# Altium schematic sheet schematic.SchDoc
size 533 x 331 mm
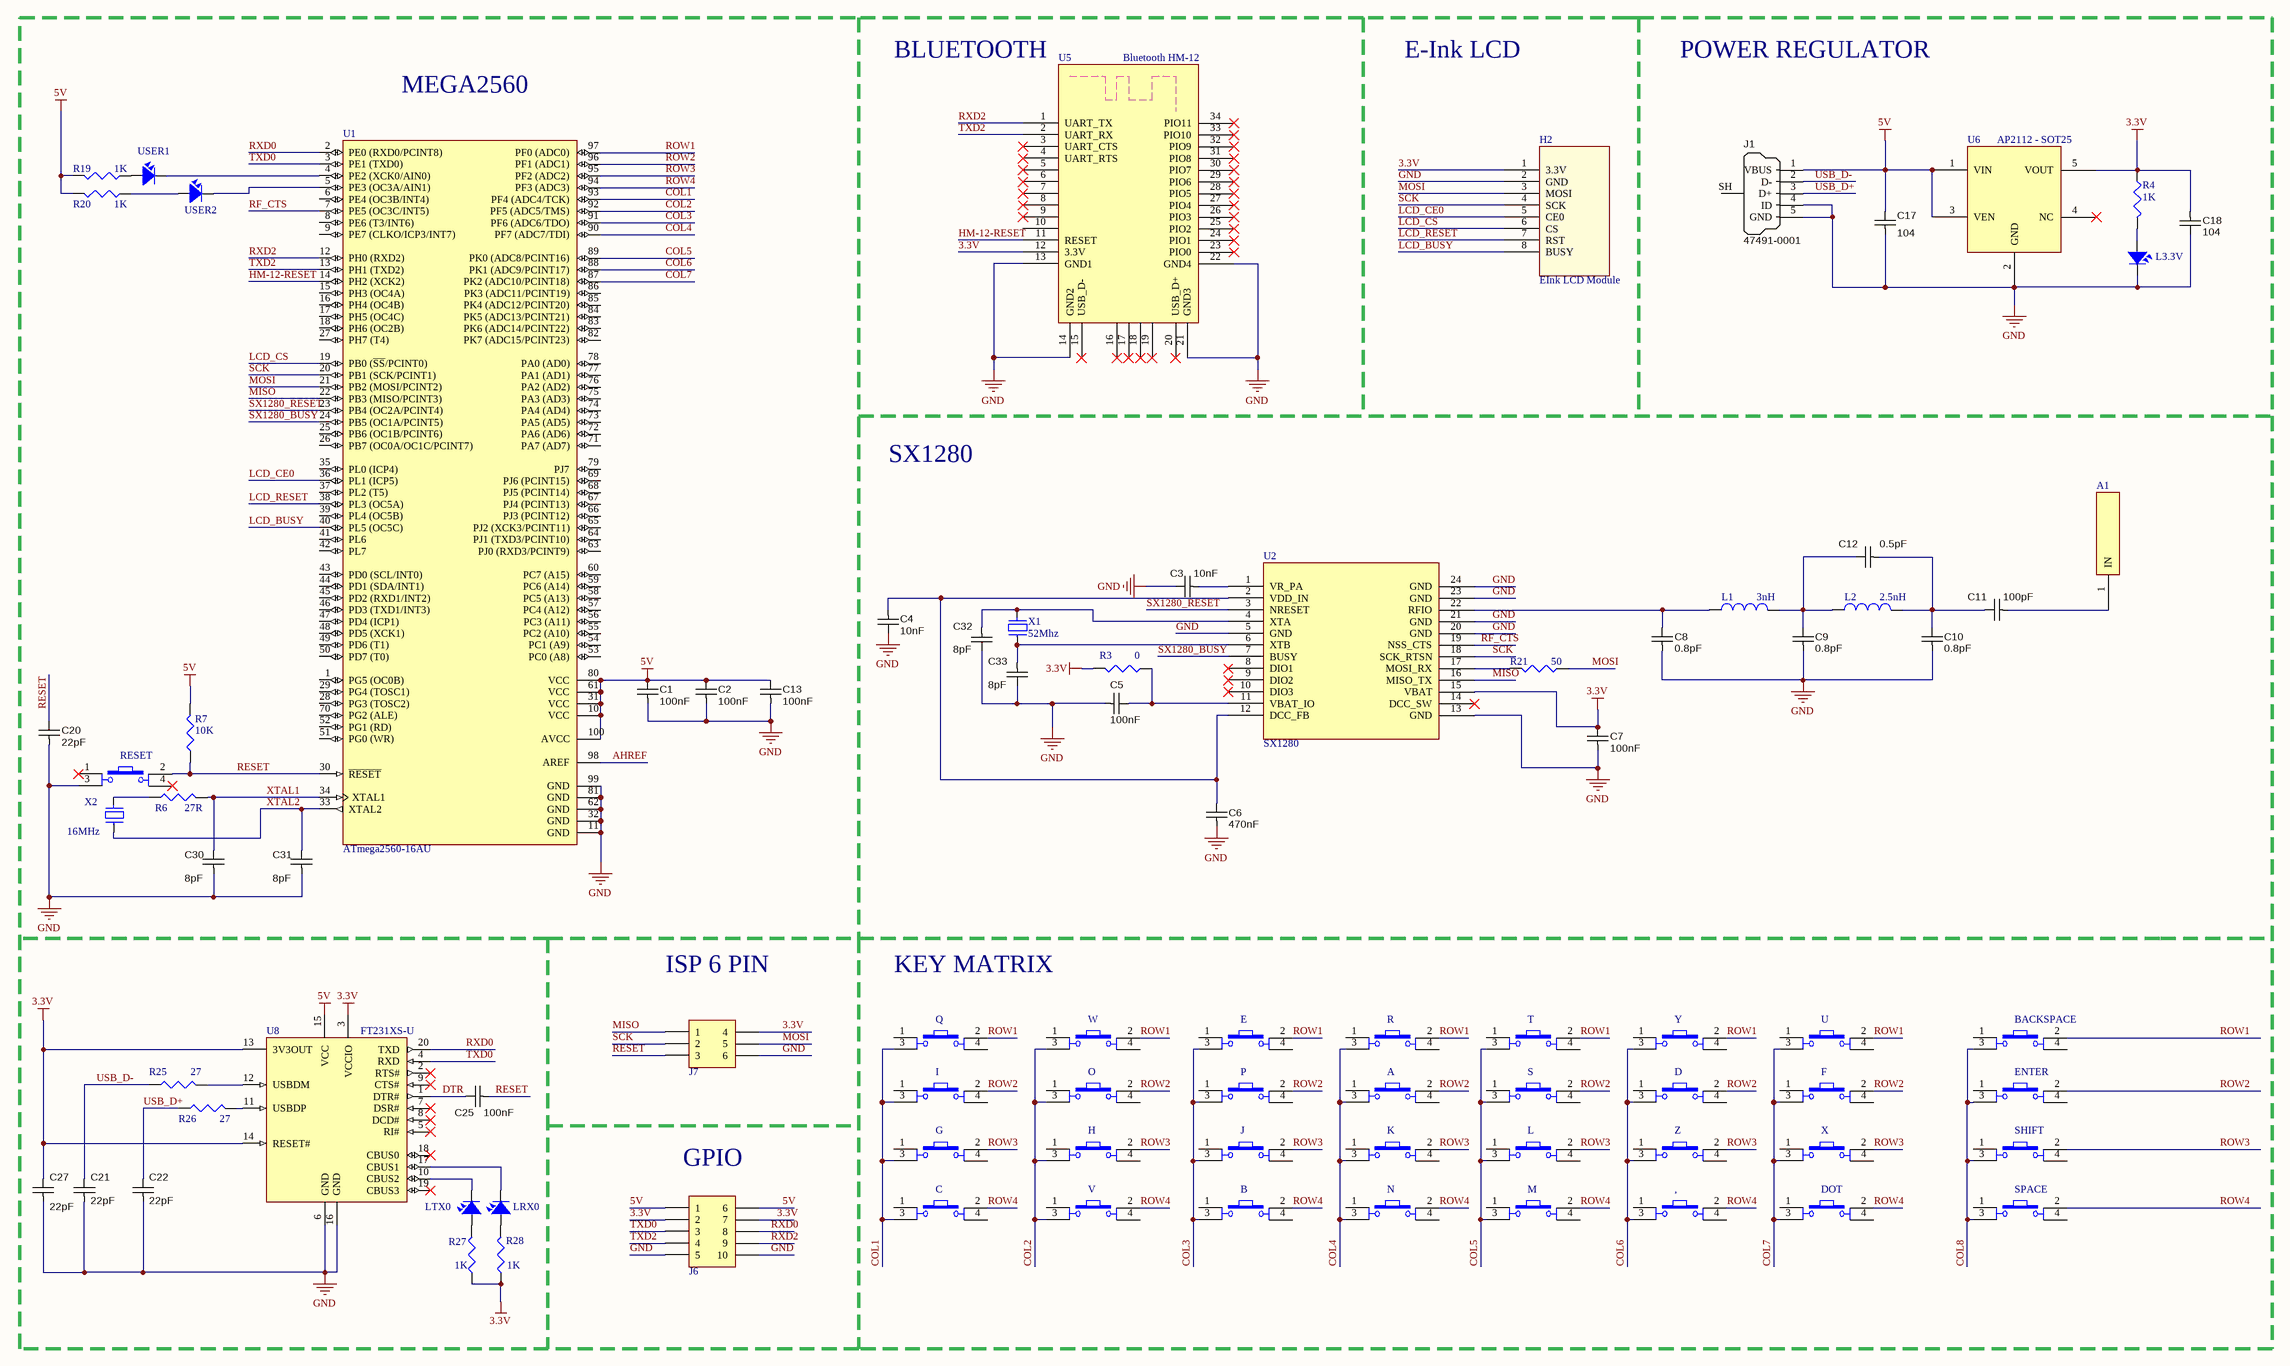
[diagram p0: schematic.SchDoc]

## Parts
,  SW  [Kha_Button]  (value not drawn)
A  SW  [Kha_Button]  (value not drawn)
A1  Antenna  [Antenna]  (value not drawn)
B  SW  [Kha_Button]  (value not drawn)
BACKSPACE  SW  [Kha_Button]  (value not drawn)
C  SW  [Kha_Button]  (value not drawn)
C1  value 100nF  [SMD-0603c]  (hidden comment: approved sub OK)
C2  value 100nF  [SMD-0603c]  (hidden comment: approved sub OK)
C3  value 10nF  [SMD-0603c]  (hidden comment: approved sub OK)
C4  value 10nF  [SMD-0603c]  (hidden comment: approved sub OK)
C5  value 100nF  [SMD-0603c]  (hidden comment: approved sub OK)
C6  value 470nF  [SMD-0603c]  (hidden comment: approved sub OK)
C7  value 100nF  [SMD-0603c]  (hidden comment: approved sub OK)
C8  value 0.8pF  [SMD-0603c]  (hidden comment: approved sub OK)
C9  value 0.8pF  [SMD-0603c]  (hidden comment: approved sub OK)
C10  value 0.8pF  [SMD-0603c]  (hidden comment: approved sub OK)
C11  value 100pF  [SMD-0603c]  (hidden comment: approved sub OK)
C12  value 0.5pF  [SMD-0603c]  (hidden comment: approved sub OK)
C13  value 100nF  [SMD-0603c]  (hidden comment: approved sub OK)
C17  value 104  [SMD-0603c]  (hidden comment: approved sub OK)
C18  value 104  [SMD-0603c]  (hidden comment: approved sub OK)
C20  value 22pF  [SMD-0603c]  (hidden comment: approved sub OK)
C21  value 22pF  [SMD-0603c]  (hidden comment: approved sub OK)
C22  value 22pF  [SMD-0603c]  (hidden comment: approved sub OK)
C25  value 100nF  [SMD-0603c]  (hidden comment: approved sub OK)
C27  value 22pF  [SMD-0603c]  (hidden comment: approved sub OK)
C30  value 8pF  [SMD-0603c]  (hidden comment: approved sub OK)
C31  value 8pF  [SMD-0603c]  (hidden comment: approved sub OK)
C32  value 8pF  [SMD-0603c]  (hidden comment: approved sub OK)
C33  value 8pF  [SMD-0603c]  (hidden comment: approved sub OK)
D  SW  [Kha_Button]  (value not drawn)
DOT  SW  [Kha_Button]  (value not drawn)
E  SW  [Kha_Button]  (value not drawn)
ENTER  SW  [Kha_Button]  (value not drawn)
F  SW  [Kha_Button]  (value not drawn)
G  SW  [Kha_Button]  (value not drawn)
H  SW  [Kha_Button]  (value not drawn)
H2  EInk LCD Module  [EInk_Module]
I  SW  [Kha_Button]  (value not drawn)
J  SW  [Kha_Button]  (value not drawn)
J1  Manufacturer Part Number 1: 47491-0001  [ZIF_CONN_4P_TE84953-4]  (hidden comment: USB Micro Type B)
J6  10p  [610110249121]  (value not drawn)
J7  06p  [610106249121]  (value not drawn)
K  SW  [Kha_Button]  (value not drawn)
L  SW  [Kha_Button]  (value not drawn)
L1  value 3nH  [0603]  (hidden comment: Inductor)
L2  value 2.5nH  [0603]  (hidden comment: Inductor)
L3.3V  LED SMD  [SM-LED-0805-Blue]  (value not drawn)
LRX0  LED SMD  [SM-LED-0805-Blue]  (value not drawn)
LTX0  LED SMD  [SM-LED-0805-Blue]  (value not drawn)
M  SW  [Kha_Button]  (value not drawn)
N  SW  [Kha_Button]  (value not drawn)
O  SW  [Kha_Button]  (value not drawn)
P  SW  [Kha_Button]  (value not drawn)
Q  SW  [Kha_Button]  (value not drawn)
R  SW  [Kha_Button]  (value not drawn)
R3  value 0  [J1-0603]  (hidden comment: Res3)
R4  value 1K  [J1-0603]  (hidden comment: Res3)
R6  value 27R  [J1-0603]  (hidden comment: Res3)
R7  value 10K  [J1-0603]  (hidden comment: Res3)
R19  value 1K  [J1-0603]  (hidden comment: Res3)
R20  value 1K  [J1-0603]  (hidden comment: Res3)
R21  value 50  [J1-0603]  (hidden comment: Res3)
R25  value 27  [J1-0603]  (hidden comment: Res3)
R26  value 27  [J1-0603]  (hidden comment: Res3)
R27  value 1K  [J1-0603]  (hidden comment: Res3)
R28  value 1K  [J1-0603]  (hidden comment: Res3)
RESET  SW  [Kha_Button]  (value not drawn)
S  SW  [Kha_Button]  (value not drawn)
SHIFT  SW  [Kha_Button]  (value not drawn)
SPACE  SW  [Kha_Button]  (value not drawn)
T  SW  [Kha_Button]  (value not drawn)
U  SW  [Kha_Button]  (value not drawn)
U1  ATmega2560-16AU  [100A_N]
U2  SX1280  [SX1280_QFN24 4x4]
U5  Bluetooth HM-12  [HM-12]
U6  AP2112 - SOT25  [AP2112 - SOT25]
U8  FT231XS-U  [SSOP-20_N]
USER1  LED SMD  [SM-LED-0805-Blue]  (value not drawn)
USER2  LED SMD  [SM-LED-0805-Blue]  (value not drawn)
V  SW  [Kha_Button]  (value not drawn)
W  SW  [Kha_Button]  (value not drawn)
X  SW  [Kha_Button]  (value not drawn)
X1  52Mhz  [Crystal 52MHz]
X2  16MHz  [PCBComponent_1]
Y  SW  [Kha_Button]  (value not drawn)
Z  SW  [Kha_Button]  (value not drawn)

## Nets
3.3V: C7.2 C18.1 C27.2 H2.1(3.3V) J6.2 J6.7 J7.4 R3.2 R4.1 R27.1 R28.1 U2.15(VBAT) U5.12(3.3V) U6.5(VOUT) U8.3(VCCIO) U8.13(3V3OUT) U8.14(RESET#)
5V: C1.2 C2.2 C13.2 C17.2 J1.1(VBUS) J6.1 J6.6 R7.2 R19.2 R20.2 U1.10(VCC) U1.31(VCC) U1.61(VCC) U1.80(VCC) U1.100(AVCC) U6.1(VIN) U6.3(VEN) U8.15(VCC)
GND: C1.1 C2.1 C3.2 C4.2 C5.1 C6.1 C7.1 C8.1 C9.1 C10.1 C13.1 C17.1 C18.2 C20.1 C21.1 C22.1 C27.1 C30.1 C31.1 C32.2 C33.2 H2.2(GND) J1.4(ID) J1.5(GND) J6.5 J6.10 J7.6 L3.3V.2 RESET.3 U1.11(GND) U1.32(GND) U1.62(GND) U1.81(GND) U1.99(GND) U2.5(GND) U2.13(GND) U2.20(GND) U2.21(GND) U2.23(GND) U2.24(GND) U5.13(GND1) U5.14(GND2) U5.21(GND3) U5.22(GND4) U6.2(GND) U8.6(GND) U8.16(GND)
AHREF: U1.98(AREF)
COL1: C.3 G.3 I.3 Q.3 U1.93(PF4_(ADC4/TCK))
COL2: H.3 O.3 U1.92(PF5_(ADC5/TMS)) V.3 W.3
COL3: B.3 E.3 J.3 P.3 U1.91(PF6_(ADC6/TDO))
COL4: A.3 K.3 N.3 R.3 U1.90(PF7_(ADC7/TDI))
COL5: L.3 M.3 S.3 T.3 U1.89(PK0_(ADC8/PCINT16))
COL6: ,.3 D.3 U1.88(PK1_(ADC9/PCINT17)) Y.3 Z.3
COL7: DOT.3 F.3 U.3 U1.87(PK2_(ADC10/PCINT18)) X.3
COL8: BACKSPACE.3 ENTER.3 SHIFT.3 SPACE.3
DTR: C25.2 U8.1(DTR#)
HM-12-RESET: U1.14(PH2_(XCK2)) U5.11(RESET)
LCD_BUSY: H2.8(BUSY) U1.40(PL5_(OC5C))
LCD_CE0: H2.5(CE0) U1.36(PL1_(ICP5))
LCD_CS: H2.6(CS) U1.19(PB0_(~{SS}/PCINT0))
LCD_RESET: H2.7(RST) U1.38(PL3_(OC5A))
MISO: J7.1 U1.22(PB3_(MISO/PCINT3)) U2.16(MISO_TX)
MOSI: H2.3(MOSI) J7.5 R21.1 U1.21(PB2_(MOSI/PCINT2))
RESET: C20.2 C25.1 J7.3 R7.1 RESET.2 U1.30(~{RESET})
RF_CTS: U1.7(PE5_(OC3C/INT5)) U2.19(NSS_CTS)
ROW1: BACKSPACE.2 E.2 Q.2 R.2 T.2 U.2 U1.97(PF0_(ADC0)) W.2 Y.2
ROW2: A.2 D.2 ENTER.2 F.2 I.2 O.2 P.2 S.2 U1.96(PF1_(ADC1))
ROW3: G.2 H.2 J.2 K.2 L.2 SHIFT.2 U1.95(PF2_(ADC2)) X.2 Z.2
ROW4: ,.2 B.2 C.2 DOT.2 M.2 N.2 SPACE.2 U1.94(PF3_(ADC3)) V.2
RXD0: J6.8 U1.2(PE0_(RXD0/PCINT8)) U8.20(TXD)
RXD2: J6.9 U1.12(PH0_(RXD2)) U5.1(UART_TX)
SCK: H2.4(SCK) J7.2 U1.20(PB1_(SCK/PCINT1)) U2.18(SCK_RTSN)
SX1280_BUSY: U1.24(PB5_(OC1A/PCINT5)) U2.7(BUSY)
SX1280_RESET: U1.23(PB4_(OC2A/PCINT4)) U2.3(NRESET)
TXD0: J6.3 U1.3(PE1_(TXD0)) U8.4(RXD)
TXD2: J6.4 U1.13(PH1_(TXD2)) U5.2(UART_RX)
USB_D+: C22.2 J1.3(D+) R26.1
USB_D-: C21.2 J1.2(D-) R25.1
XTAL1: C30.2 R6.2 U1.34(XTAL1)
XTAL2: C31.2 U1.33(XTAL2) X2.1
NetA1_1: A1.1(IN) C11.1
NetC3_1: C3.1 U2.1(VR_PA)
NetC4_1: C4.1 C6.2 U2.2(VDD_IN) U2.12(DCC_FB)
NetC5_2: C5.2 R3.1 U2.11(VBAT_IO)
NetC8_2: C8.2 L1.1 U2.22(RFIO)
NetC9_2: C9.2 C12.2 L1.2 L2.1
NetC10_2: C10.2 C11.2 C12.1 L2.2
NetC32_1: C32.1 U2.4(XTA) X1.3
NetC33_1: C33.1 U2.6(XTB) X1.1
NetL3.3V_1: L3.3V.1 R4.2
NetLRX0_1: LRX0.1 R28.2
NetLRX0_2: LRX0.2 U8.17(CBUS1)
NetLTX0_1: LTX0.1 R27.2
NetLTX0_2: LTX0.2 U8.10(CBUS2)
NetR6_1: R6.1 X2.2
NetR19_1: R19.1 USER1.1
NetR20_1: R20.1 USER2.1
NetR21_2: R21.2 U2.17(MOSI_RX)
NetR25_2: R25.2 U8.12(USBDM)
NetR26_2: R26.2 U8.11(USBDP)
NetU1_4: U1.4(PE2_(XCK0/AIN0)) USER1.2
NetU1_5: U1.5(PE3_(OC3A/AIN1)) USER2.2

Not connected (* = marked no-connect by the designer): , 1 4; A 1 4; B 1 4; BACKSPACE 1 4; C 1 4; D 1 4; DOT 1 4; E 1 4; ENTER 1 4; F 1 4; G 1 4; H 1 4; I 1 4; J 1 4; J1 SH(Shell); K 1 4; L 1 4; M 1 4; N 1 4; O 1 4; P 1 4; Q 1 4; R 1 4; RESET 1* 4*; S 1 4; SHIFT 1 4; SPACE 1 4; T 1 4; U 1 4; U1 1(PG5_(OC0B)) 6(PE4_(OC3B/INT4)) 8(PE6_(T3/INT6)) 9(PE7_(CLKO/ICP3/INT7)) 15(PH3_(OC4A)) 16(PH4_(OC4B)) 17(PH5_(OC4C)) 18(PH6_(OC2B)) 25(PB6_(OC1B/PCINT6)) 26(PB7_(OC0A/OC1C/PCINT7)) 27(PH7_(T4)) 28(PG3_(TOSC2)) 29(PG4_(TOSC1)) 35(PL0_(ICP4)) 37(PL2_(T5)) 39(PL4_(OC5B)) 41(PL6) 42(PL7) 43(PD0_(SCL/INT0)) 44(PD1_(SDA/INT1)) 45(PD2_(RXD1/INT2)) 46(PD3_(TXD1/INT3)) 47(PD4_(ICP1)) 48(PD5_(XCK1)) 49(PD6_(T1)) 50(PD7_(T0)) 51(PG0_(WR)) 52(PG1_(RD)) 53(PC0_(A8)) 54(PC1_(A9)) 55(PC2_(A10)) 56(PC3_(A11)) 57(PC4_(A12)) 58(PC5_(A13)) 59(PC6_(A14)) 60(PC7_(A15)) 63(PJ0_(RXD3/PCINT9)) 64(PJ1_(TXD3/PCINT10)) 65(PJ2_(XCK3/PCINT11)) 66(PJ3_(PCINT12)) 67(PJ4_(PCINT13)) 68(PJ5_(PCINT14)) 69(PJ6_(PCINT15)) 70(PG2_(ALE)) 71(PA7_(AD7)) 72(PA6_(AD6)) 73(PA5_(AD5)) 74(PA4_(AD4)) 75(PA3_(AD3)) 76(PA2_(AD2)) 77(PA1_(AD1)) 78(PA0_(AD0)) 79(PJ7) 82(PK7_(ADC15/PCINT23)) 83(PK6_(ADC14/PCINT22)) 84(PK5_(ADC13/PCINT21)) 85(PK4_(ADC12/PCINT20)) 86(PK3_(ADC11/PCINT19)); U2 8(DIO1)* 9(DIO2)* 10(DIO3)* 14(DCC_SW)*; U5 3(UART_CTS)* 4(UART_RTS)* 5* 6* 7* 8* 9* 10 15(USB_D-)* 16* 17* 18* 19* 20(USB_D+)* 23(PIO0)* 24(PIO1)* 25(PIO2)* 26(PIO3)* 27(PIO4)* 28(PIO5)* 29(PIO6)* 30(PIO7)* 31(PIO8)* 32(PIO9)* 33(PIO10)* 34(PIO11)*; U6 4(NC)*; U8 2(RTS#)* 5(RI#)* 7(DSR#)* 8(DCD#)* 9(CTS#)* 18(CBUS0)* 19(CBUS3)*; V 1 4; W 1 4; X 1 4; Y 1 4; Z 1 4

## Notes on the sheet
- MEGA2560
- BLUETOOTH
- E-Ink LCD
- POWER REGULATOR
- SX1280
- ISP 6 PIN
- KEY MATRIX
- (near J6) GPIO

## Library data of the parts
, A B BACKSPACE C D DOT E ENTER F G H I J K L M N O P Q R RESET S SHIFT SPACE T U V W X Y Z = SW4: Switch button 4 pin; Value: Button chip 4 pin
C1-C13 C17 C18 C20-C22 C25 C27 C30-C33 = CAPC_1n_0603_X7R_100V_10%: Capacitor SMD Cer 1nF 10% 100V X7R 0603; Manufacturer 1: Murata Electronics North America; Manufacturer Part Number 1: GCM188R72A102KA37D; Ratings: 100V; X7R; Material: ceramic; SCDType: spec; Package / Case: 0603 (1608 metric); Tolerance: ±10%; Supplier 1: Digi-Key; Supplier Part Number 1: 490-4780-1-ND; Operating Temperature: -55°C ~ 125°C; Size / Dimension: 0.063" L x 0.031" W (1.60mm x 0.80mm); Thickness (Max): 0.035" (0.90mm); ComponentLink1URL: http://search.murata.co.jp/Ceramy/image/img/PDF/ENG/GCM188R72A102KA37.pdf; ComponentLink1Description: http://search.murata.co.jp/Ceramy/image/img/PDF/ENG/GCM188R72A102KA37.pdf
H2 = E-Ink LCD
J1 = USB_Micro_TypeB: Connector SMD USB Micro Type B middle mount; Manufacturer 1: Molex Inc; SCDType: undef; Package / Case: SMD; Supplier 1: Digi-Key; Supplier Part Number 1: WM17142CT-ND
J6 = 610110249121: WR-PHD 2.54 mm Pin Header - SMT Type Double Row Right Angled, 10p; PublishedDate: July 2016; Publisher: Wurth Elektronik; ComponentLink1Description: Manufacturer; ComponentLink1URL: http://www.we-online.de; ComponentLink2Description: Datasheet; ComponentLink2URL: http://katalog.we-online.de/em/datasheet/6101xx249121.pdf; PartNumber: 610110249121; PinNumber: 10p
J7 = 610106249121: WR-PHD 2.54 mm Pin Header - SMT Type Double Row Right Angled, 06p; PublishedDate: July 2016; Publisher: Wurth Elektronik; ComponentLink1Description: Manufacturer; ComponentLink1URL: http://www.we-online.de; ComponentLink2Description: Datasheet; ComponentLink2URL: http://katalog.we-online.de/em/datasheet/6101xx249121.pdf; PartNumber: 610106249121; PinNumber: 06p
L1 L2 = Inductor: Code_IEC: 1005; Published: 8-Jun-2000; LatestRevisionDate: 29-May-2009; LatestRevisionNote: IPC-7351 Footprint Added.; PackageReference: 0402-A; Publisher: Altium Limited; PackageDescription: Chip Inductor; Code_JEITA: 0402
L3.3V LRX0 LTX0 USER1 USER2 = LED-SMD-0805
R3 R4 R6 R7 R19-R21 R25-R28 = Res3: Resistor; Published: 8-Jun-2000; LatestRevisionDate: 29-May-2009; LatestRevisionNote: IPC-7351 Footprint Added.; PackageReference: J1-0603; Publisher: Altium Limited; PackageDescription: Chip Resistor
U1 = ATmega2560-16AU: 8-bit AVR Microcontroller, 4.5-5.5V, 256KB Flash, 4KB EEPROM, 8KB SRAM, 86 GPIO pins, 100-pin TQFP, Industrial Grade (-40°C to 85°C), Pb-Free; Published: 1-Apr-2010; DatasheetVersion: revL, Aug-2007; PackageVersion: revC, Oct-2001; PackageReference: 100A; Publisher: Altium Limited; PackageDescription: 100-Pin Thin Profile Plastic Quad Flat Pack (TQFP), 14 x 14 x 1.0 mm Body, 0.5 mm Pitch; Supplier 1: Digi-Key; Supplier Part Number 1: ATMEGA2560-16AU-ND; Supplier 2: Farnell; Supplier Part Number 2: 1288330; Supplier 3: Farnell; Supplier Part Number 3: 1661740; Supplier 4: Mouser; Supplier Part Number 4: 556-ATMEGA2560-16AU; Code_JEDEC: MS-026-AED; ComponentLink1Description: Manufacturer Link; ComponentLink1URL: http://www.atmel.com/products/avr/default.asp?; ComponentLink2Description: ATmega640/1280/1281/2560/2561 Datasheet; ComponentLink2URL: http://www.atmel.com/dyn/resources/prod_documents/doc2549.pdf; ComponentLink3Description: ATmega640/1280/1281/2560/2561 Summary; ComponentLink3URL: http://www.atmel.com/dyn/resources/prod_documents/2549S.pdf; ComponentLink4Description: Atmel.com Home; ComponentLink4URL: http://www.atmel.com
U5 = HM-12
U8 = FT231XS-U: USB to Full-Handshake UART Interface Chip, UHCI/OHCI/EHCI Compatible, USB 2.0 Compatible, -40 to +85 degC, 20-Pin SSOP, Pb-Free, Tube; Manufacturer: FTDI; DatasheetVersion: ver 1.2, Feb-2013; PackageVersion: Feb-13; PackageReference: SSOP-20; PackageDescription: 20-Pin Small Outline Package, 8.6 x 3.9 mm Body, 0.635 mm Pitch; Code_JEDEC: MO-137-AD; PartNumber: FT231XS-U; ComponentLink1Description: Manufacturer URL; ComponentLink1URL: http://www.ftdichip.com/; ComponentLink2Description: Datasheet; ComponentLink2URL: http://www.ftdichip.com/Support/Documents/DataSheets/ICs/DS_FT231X.pdf; ComponentLink3Description: FT231X Product Page; ComponentLink3URL: www.ftdichip.com/Products/ICs/FT231X.html
X1 X2 = XT2: Crystal For all Crystal 2pin.; Value: 4Mhz